# EAGLE design controller (EAGLE 4.11)
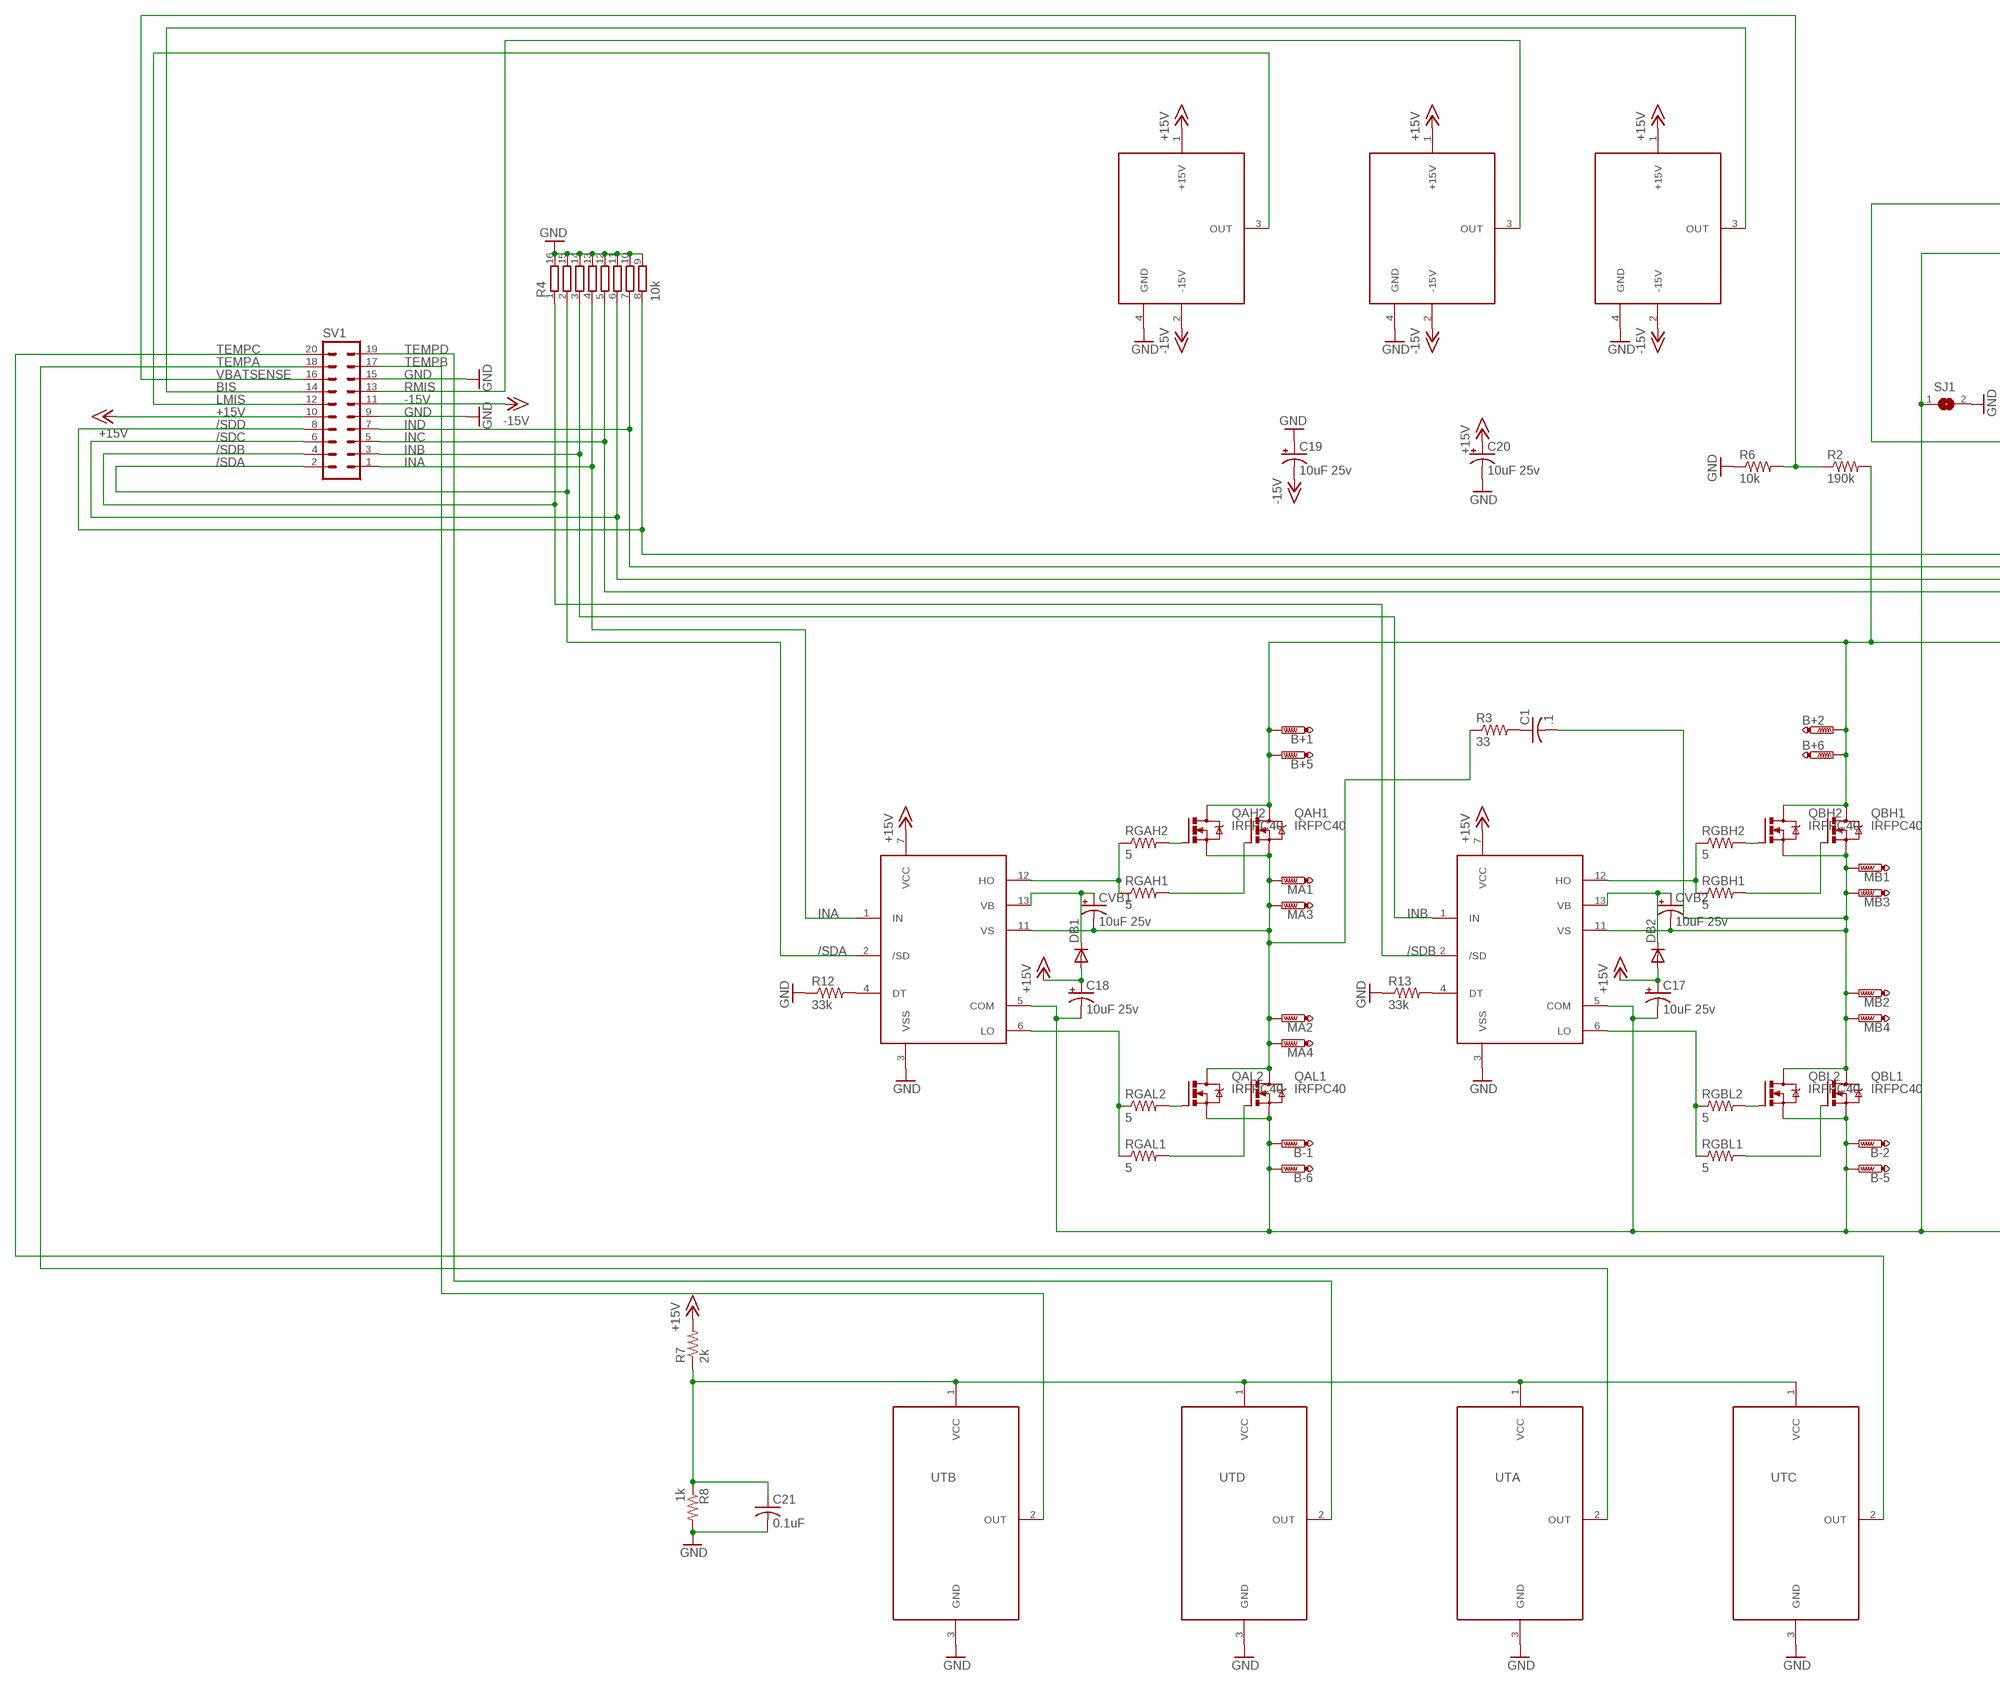
[diagram p0: schematic, sheet 1, part 1 of 2]
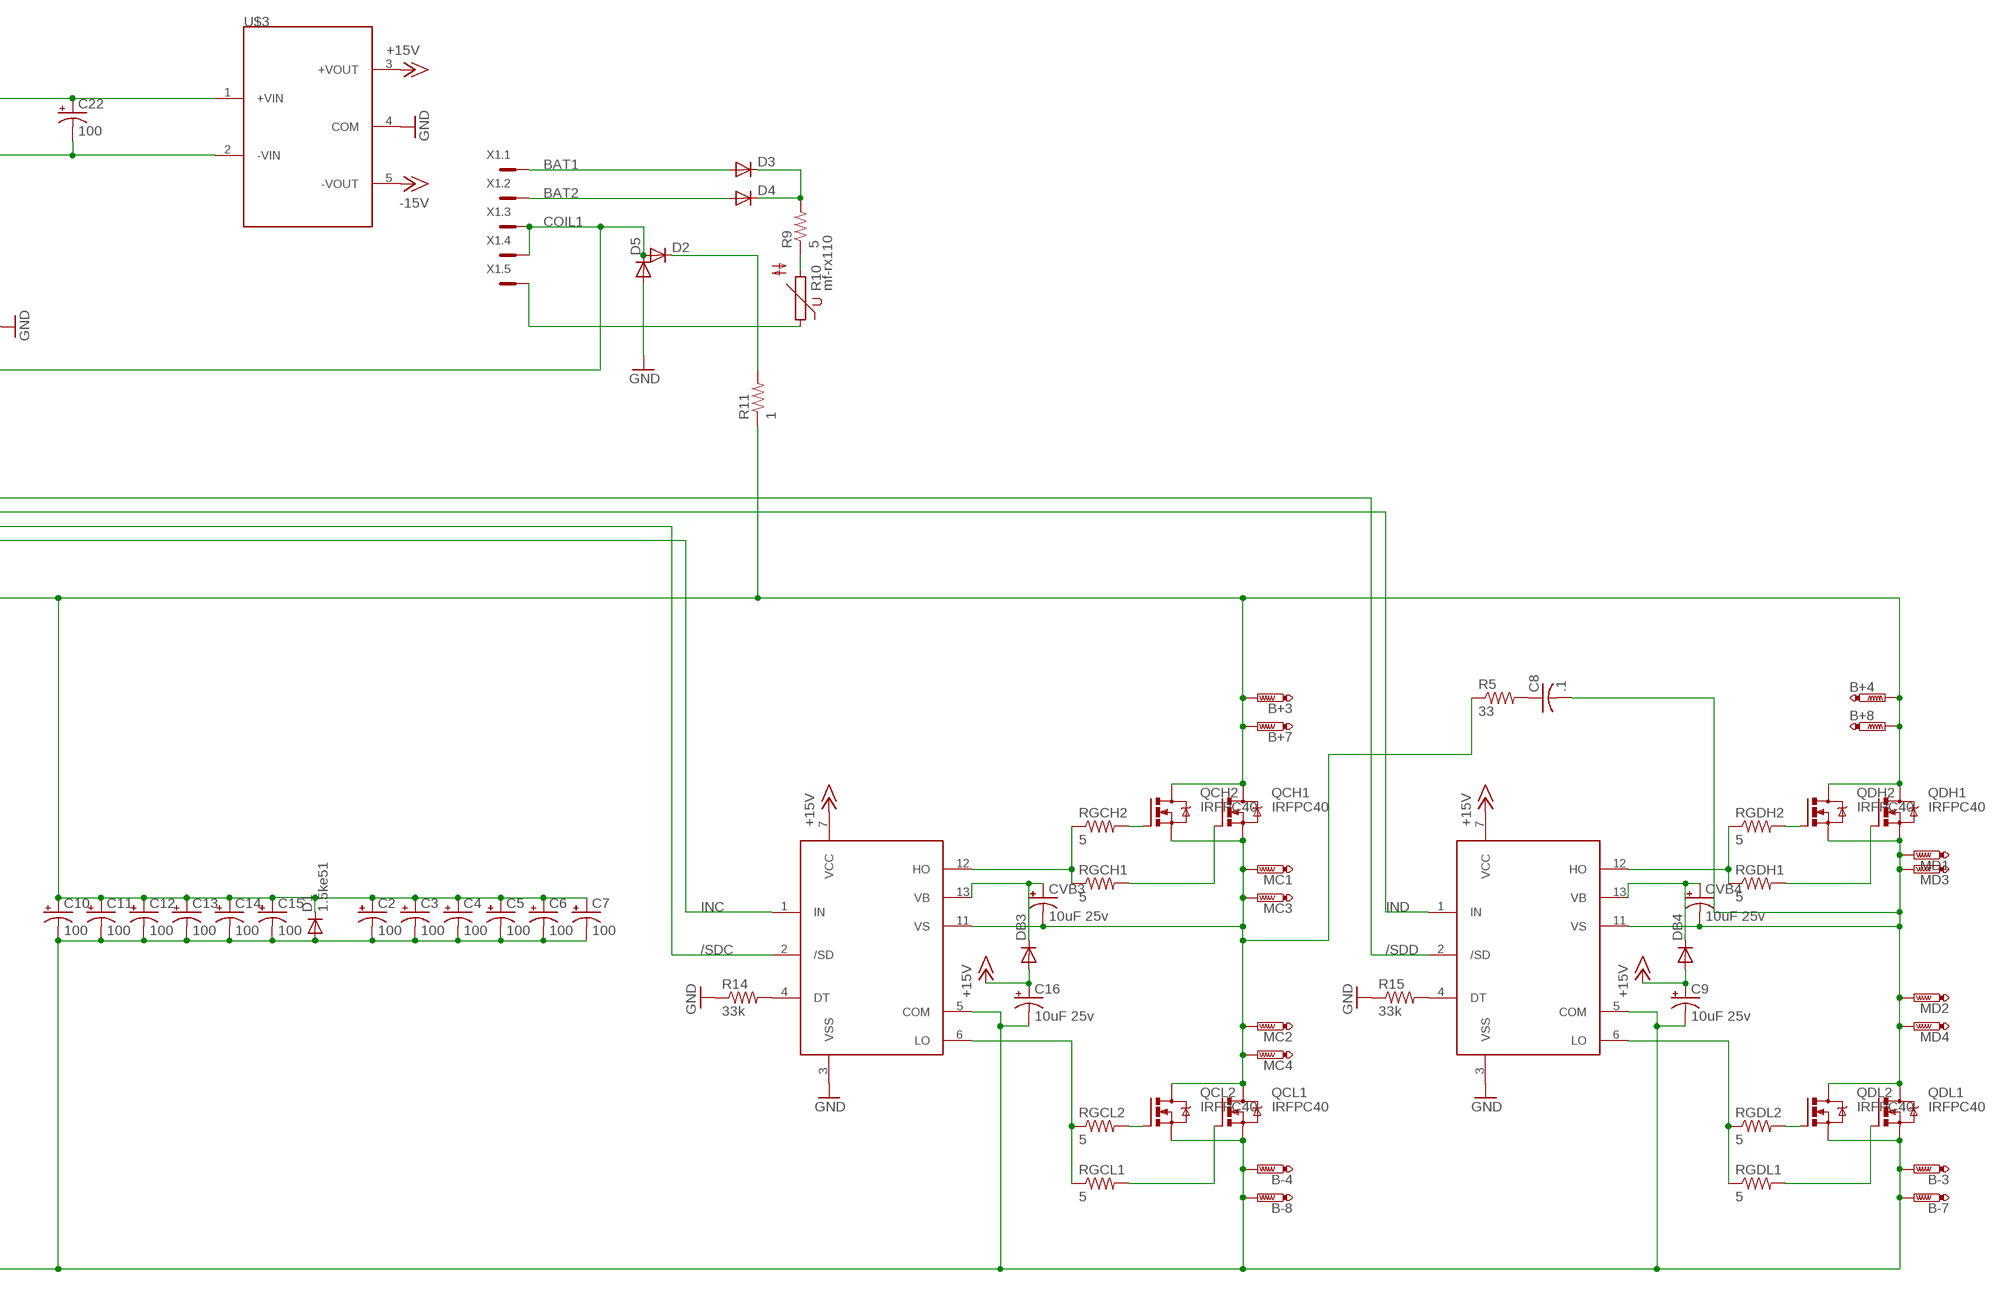
[diagram p1: schematic, sheet 1, part 2 of 2]

## Parts
B+1  PTR1PAD1-17Y  [P1-17Y]
B+2  PTR1PAD1-17Y  [P1-17Y]
B+3  PTR1PAD1-17Y  [P1-17Y]
B+4  PTR1PAD1-17Y  [P1-17Y]
B+5  PTR1PAD1-17Y  [P1-17Y]
B+6  PTR1PAD1-17Y  [P1-17Y]
B+7  PTR1PAD1-17Y  [P1-17Y]
B+8  PTR1PAD1-17Y  [P1-17Y]
B-1  PTR1PAD1-17Y  [P1-17Y]
B-2  PTR1PAD1-17Y  [P1-17Y]
B-3  PTR1PAD1-17Y  [P1-17Y]
B-4  PTR1PAD1-17Y  [P1-17Y]
B-5  PTR1PAD1-17Y  [P1-17Y]
B-6  PTR1PAD1-17Y  [P1-17Y]
B-7  PTR1PAD1-17Y  [P1-17Y]
B-8  PTR1PAD1-17Y  [P1-17Y]
C1  .1  C-US050-050X075  [C050-050X075]
C2  100  CPOL-USE2.5-7  [E2,5-7]
C3  100  CPOL-USE2.5-7  [E2,5-7]
C4  100  CPOL-USE2.5-7  [E2,5-7]
C5  100  CPOL-USE2.5-7  [E2,5-7]
C6  100  CPOL-USE2.5-7  [E2,5-7]
C7  100  CPOL-USE2.5-7  [E2,5-7]
C8  .1  C-US050-050X075  [C050-050X075]
C9  10uF 25v  CPOL-USC/6032-28R  [C/6032-28R]
C10  100  CPOL-USE2.5-7  [E2,5-7]
C11  100  CPOL-USE2.5-7  [E2,5-7]
C12  100  CPOL-USE2.5-7  [E2,5-7]
C13  100  CPOL-USE2.5-7  [E2,5-7]
C14  100  CPOL-USE2.5-7  [E2,5-7]
C15  100  CPOL-USE2.5-7  [E2,5-7]
C16  10uF 25v  CPOL-USC/6032-28R  [C/6032-28R]
C17  10uF 25v  CPOL-USC/6032-28R  [C/6032-28R]
C18  10uF 25v  CPOL-USC/6032-28R  [C/6032-28R]
C19  10uF 25v  CPOL-USC/6032-28R  [C/6032-28R]
C20  10uF 25v  CPOL-USC/6032-28R  [C/6032-28R]
C21  0.1uF  C-USC0805  [C0805]
C22  100  CPOL-USE2.5-7  [E2,5-7]
CVB1  10uF 25v  CPOL-USC/6032-28R  [C/6032-28R]
CVB2  10uF 25v  CPOL-USC/6032-28R  [C/6032-28R]
CVB3  10uF 25v  CPOL-USC/6032-28R  [C/6032-28R]
CVB4  10uF 25v  CPOL-USC/6032-28R  [C/6032-28R]
D1  1.5ke51  DIODE-DO201-15  [DO201-15]
D2  DIODE-DO41-10  [DO41-10]
D3  DIODE-DO41-10  [DO41-10]
D4  DIODE-DO41-10  [DO41-10]
D5  DIODE-DO41-10  [DO41-10]
DB1  DIODE-SOD323-W  [SOD323-W]
DB2  DIODE-SOD323-W  [SOD323-W]
DB3  DIODE-SOD323-W  [SOD323-W]
DB4  DIODE-SOD323-W  [SOD323-W]
DRV1  IR21844S  [14-SOIC]
DRV2  IR21844S  [14-SOIC]
DRV3  IR21844S  [14-SOIC]
DRV4  IR21844S  [14-SOIC]
MA1  PTR1PAD1-17Y  [P1-17Y]
MA2  PTR1PAD1-17Y  [P1-17Y]
MA3  PTR1PAD1-17Y  [P1-17Y]
MA4  PTR1PAD1-17Y  [P1-17Y]
MB1  PTR1PAD1-17Y  [P1-17Y]
MB2  PTR1PAD1-17Y  [P1-17Y]
MB3  PTR1PAD1-17Y  [P1-17Y]
MB4  PTR1PAD1-17Y  [P1-17Y]
MC1  PTR1PAD1-17Y  [P1-17Y]
MC2  PTR1PAD1-17Y  [P1-17Y]
MC3  PTR1PAD1-17Y  [P1-17Y]
MC4  PTR1PAD1-17Y  [P1-17Y]
MD1  PTR1PAD1-17Y  [P1-17Y]
MD2  PTR1PAD1-17Y  [P1-17Y]
MD3  PTR1PAD1-17Y  [P1-17Y]
MD4  PTR1PAD1-17Y  [P1-17Y]
QAH1  IRFPC40  [TO247BV]
QAH2  IRFPC40  [TO247BV]
QAL1  IRFPC40  [TO247BV]
QAL2  IRFPC40  [TO247BV]
QBH1  IRFPC40  [TO247BV]
QBH2  IRFPC40  [TO247BV]
QBL1  IRFPC40  [TO247BV]
QBL2  IRFPC40  [TO247BV]
QCH1  IRFPC40  [TO247BV]
QCH2  IRFPC40  [TO247BV]
QCL1  IRFPC40  [TO247BV]
QCL2  IRFPC40  [TO247BV]
QDH1  IRFPC40  [TO247BV]
QDH2  IRFPC40  [TO247BV]
QDL1  IRFPC40  [TO247BV]
QDL2  IRFPC40  [TO247BV]
R2  190k  R-US_R0805  [R0805]
R3  33  R-US_0414/15  [0414/15]
R4  10k  4816P-T01  [4816P]
R5  33  R-US_0414/15  [0414/15]
R6  10k  R-US_R0805  [R0805]
R7  2k  R-US_R0805  [R0805]
R8  1k  R-US_R0805  [R0805]
R9  5  R-US_0414/15  [0414/15]
R10  mf-rx110  S05K40  [S05K40]
R11  1  R-US_0414/15  [0414/15]
R12  33k  R-US_R0805  [R0805]
R13  33k  R-US_R0805  [R0805]
R14  33k  R-US_R0805  [R0805]
R15  33k  R-US_R0805  [R0805]
RGAH1  5  R-US_R0805  [R0805]
RGAH2  5  R-US_R0805  [R0805]
RGAL1  5  R-US_R0805  [R0805]
RGAL2  5  R-US_R0805  [R0805]
RGBH1  5  R-US_R0805  [R0805]
RGBH2  5  R-US_R0805  [R0805]
RGBL1  5  R-US_R0805  [R0805]
RGBL2  5  R-US_R0805  [R0805]
RGCH1  5  R-US_R0805  [R0805]
RGCH2  5  R-US_R0805  [R0805]
RGCL1  5  R-US_R0805  [R0805]
RGCL2  5  R-US_R0805  [R0805]
RGDH1  5  R-US_R0805  [R0805]
RGDH2  5  R-US_R0805  [R0805]
RGDL1  5  R-US_R0805  [R0805]
RGDL2  5  R-US_R0805  [R0805]
SJ1  SJ  [SJ]
SV1  MA10-2  [MA10-2]
U$1  L08P150D15  [L08P]
U$2  L08P150D15  [L08P]
U$3  DFC10U48D15  [DFC10]
U$5  L08P150D15  [L08P]
UTA  LM61BIM  [SOT23]
UTB  LM61BIM  [SOT23]
UTC  LM61BIM  [SOT23]
UTD  LM61BIM  [SOT23]
X1  MC5  [MC5]

## Nets
+15V [pwr]: C9.+ C16.+ C17.+ C18.+ C20.+ DB1.A DB2.A DB3.A DB4.A DRV1.7(VCC) DRV2.7(VCC) DRV3.7(VCC) DRV4.7(VCC) R7.2 SV1.10 U$1.1(+15V) U$2.1(+15V) U$3.3(+VOUT) U$5.1(+15V)
-15V [pwr]: C19.- SV1.11 U$1.2(-15V) U$2.2(-15V) U$3.5(-VOUT) U$5.2(-15V)
/SDA: DRV1.2(/SD) R4.2 SV1.2
/SDB: DRV2.2(/SD) R4.1 SV1.4
/SDC: DRV3.2(/SD) R4.6 SV1.6
/SDD: DRV4.2(/SD) R4.8 SV1.8
B+ [highpwr]: B+1.1(TP) B+2.1(TP) B+3.1(TP) B+4.1(TP) B+5.1(TP) B+6.1(TP) B+7.1(TP) B+8.1(TP) C2.+ C3.+ C4.+ C5.+ C6.+ C7.+ C10.+ C11.+ C12.+ C13.+ C14.+ C15.+ D1.C QAH1.D QAH2.D QBH1.D QBH2.D QCH1.D QCH2.D QDH1.D QDH2.D R2.2 R11.1
B- [highpwr]: B-1.1(TP) B-2.1(TP) B-3.1(TP) B-4.1(TP) B-5.1(TP) B-6.1(TP) B-7.1(TP) B-8.1(TP) C2.- C3.- C4.- C5.- C6.- C7.- C9.- C10.- C11.- C12.- C13.- C14.- C15.- C16.- C17.- C18.- C22.- D1.A DRV1.5(COM) DRV2.5(COM) DRV3.5(COM) DRV4.5(COM) QAL1.S QAL2.S QBL1.S QBL2.S QCL1.S QCL2.S QDL1.S QDL2.S SJ1.1 U$3.2(-VIN)
BAT1 [highsig]: D3.A X1.1
BAT2 [highsig]: D4.A X1.2
BIS: SV1.14 U$5.3(OUT)
COIL1 [highpwr]: C22.+ D2.A D5.C U$3.1(+VIN) X1.3 X1.4
GAH [highsig]: DRV1.12(HO) RGAH1.1 RGAH2.1
GAH1 [highsig]: DRV3.12(HO) RGCH1.1 RGCH2.1
GAL [highsig]: DRV1.6(LO) RGAL1.1 RGAL2.1
GAL1 [highsig]: DRV3.6(LO) RGCL1.1 RGCL2.1
GBH [highsig]: DRV2.12(HO) RGBH1.1 RGBH2.1
GBH1 [highsig]: DRV4.12(HO) RGDH1.1 RGDH2.1
GBL [highsig]: DRV2.6(LO) RGBL1.1 RGBL2.1
GBL1 [highsig]: DRV4.6(LO) RGDL1.1 RGDL2.1
GND [pwr]: C19.+ C20.- C21.2 D5.A DRV1.3(VSS) DRV2.3(VSS) DRV3.3(VSS) DRV4.3(VSS) R4.9 R4.10 R4.11 R4.12 R4.13 R4.14 R4.15 R4.16 R6.1 R8.2 R12.1 R13.1 R14.1 R15.1 SJ1.2 SV1.9 SV1.15 U$1.4(GND) U$2.4(GND) U$3.4(COM) U$5.4(GND) UTA.3(GND) UTB.3(GND) UTC.3(GND) UTD.3(GND)
INA: DRV1.1(IN) R4.4 SV1.1
INB: DRV2.1(IN) R4.3 SV1.3
INC: DRV3.1(IN) R4.5 SV1.5
IND: DRV4.1(IN) R4.7 SV1.7
LM61PWR: C21.1 R7.1 R8.1 UTA.1(VCC) UTB.1(VCC) UTC.1(VCC) UTD.1(VCC)
LMIS: SV1.12 U$1.3(OUT)
MA1 [highpwr]: CVB3.- DRV3.11(VS) MC1.1(TP) MC2.1(TP) MC3.1(TP) MC4.1(TP) QCH1.S QCH2.S QCL1.D QCL2.D R5.1
MA2 [highpwr]: CVB1.- DRV1.11(VS) MA1.1(TP) MA2.1(TP) MA3.1(TP) MA4.1(TP) QAH1.S QAH2.S QAL1.D QAL2.D R3.1
MB1 [highpwr]: C8.2 CVB4.- DRV4.11(VS) MD1.1(TP) MD2.1(TP) MD3.1(TP) MD4.1(TP) QDH1.S QDH2.S QDL1.D QDL2.D
MB2 [highpwr]: C1.2 CVB2.- DRV2.11(VS) MB1.1(TP) MB2.1(TP) MB3.1(TP) MB4.1(TP) QBH1.S QBH2.S QBL1.D QBL2.D
N$1 [highpwr]: D2.C R11.2
N$2: C1.1 R3.2
N$3: DRV1.4(DT) R12.2
N$4: C8.1 R5.2
N$5: DRV3.4(DT) R14.2
N$6: DRV4.4(DT) R15.2
N$7 [highsig]: R9.1 R10.2
N$8 [highsig]: D3.C D4.C R9.2
N$9: DRV2.4(DT) R13.2
N$10 [highpwr]: R10.1 X1.5
Q1G [highsig]: QAH1.G RGAH1.2
Q1G1 [highsig]: QCH1.G RGCH1.2
Q2G [highsig]: QAH2.G RGAH2.2
Q2G1 [highsig]: QCH2.G RGCH2.2
Q3G [highsig]: QAL1.G RGAL1.2
Q3G1 [highsig]: QCL1.G RGCL1.2
Q4G [highsig]: QAL2.G RGAL2.2
Q4G1 [highsig]: QCL2.G RGCL2.2
Q5G [highsig]: QBH1.G RGBH1.2
Q5G1 [highsig]: QDH1.G RGDH1.2
Q6G [highsig]: QBH2.G RGBH2.2
Q6G1 [highsig]: QDH2.G RGDH2.2
Q7G [highsig]: QBL1.G RGBL1.2
Q7G1 [highsig]: QDL1.G RGDL1.2
Q8G [highsig]: QBL2.G RGBL2.2
Q8G1 [highsig]: QDL2.G RGDL2.2
RMIS: SV1.13 U$2.3(OUT)
TEMPA: SV1.18 UTA.2(OUT)
TEMPB: SV1.17 UTB.2(OUT)
TEMPC: SV1.20 UTC.2(OUT)
TEMPD: SV1.19 UTD.2(OUT)
VB1 [pwr]: CVB1.+ DB1.C DRV1.13(VB)
VB2 [pwr]: CVB2.+ DB2.C DRV2.13(VB)
VB3 [pwr]: CVB3.+ DB3.C DRV3.13(VB)
VB4 [pwr]: CVB4.+ DB4.C DRV4.13(VB)
VBATSENSE: R2.1 R6.2 SV1.16

## Library data of the parts
B+1-B+8 B-1-B-8 MA1-MA4 MB1-MB4 MC1-MC4 MD1-MD4 = testpad:PTR1: TEST PIN
C1 C8 C21 = rcl:C-US: CAPACITOR, American symbol
C2-C7 C9-C20 C22 CVB1-CVB4 = rcl:CPOL-US: POLARIZED CAPACITOR, American symbol
D1-D5 DB1-DB4 = diode:DIODE-: DIODE
DRV1-DRV4 = tlb:IR21844S
QAH1 QAH2 QAL1 QAL2 QBH1 QBH2 QBL1 QBL2 QCH1 QCH2 QCL1 QCL2 QDH1 QDH2 QDL1 QDL2 = transistor-power:IRFPC40: N-CHANNEL MOS FET
R2 R3 R5-R9 R11-R15 RGAH1 RGAH2 RGAL1 RGAL2 RGBH1 RGBH2 RGBL1 RGBL2 RGCH1 RGCH2 RGCL1 RGCL2 RGDH1 RGDH2 RGDL1 RGDL2 = rcl:R-US_: RESISTOR, American symbol
R4 = resistor-bourns:4816P-T01: BOURNS RESISTOR NETWORK
R10 = varistor:S05K40: VARISTOR
SJ1 = jumper:SJ: SMD solder JUMPER
SV1 = con-lstb:MA10-2: PIN HEADER
U$1 U$2 U$5 = tlb:L08P150D15
U$3 = tlb:DFC10U48D15
UTA UTB UTC UTD = tlb:LM61BIM
X1 = con-phoenix-381_l:MC5: Mini-Combicon 3.81mm horizontal 5-polig (ohne Gegenstecker)

## Net classes
0 default: width 0.203 mm
1 highpwr: width 0.61 mm, clearance 0.813 mm
2 highsig: width 0.406 mm, clearance 0.61 mm
3 pwr: width 0.61 mm, clearance 0.61 mm

## Board
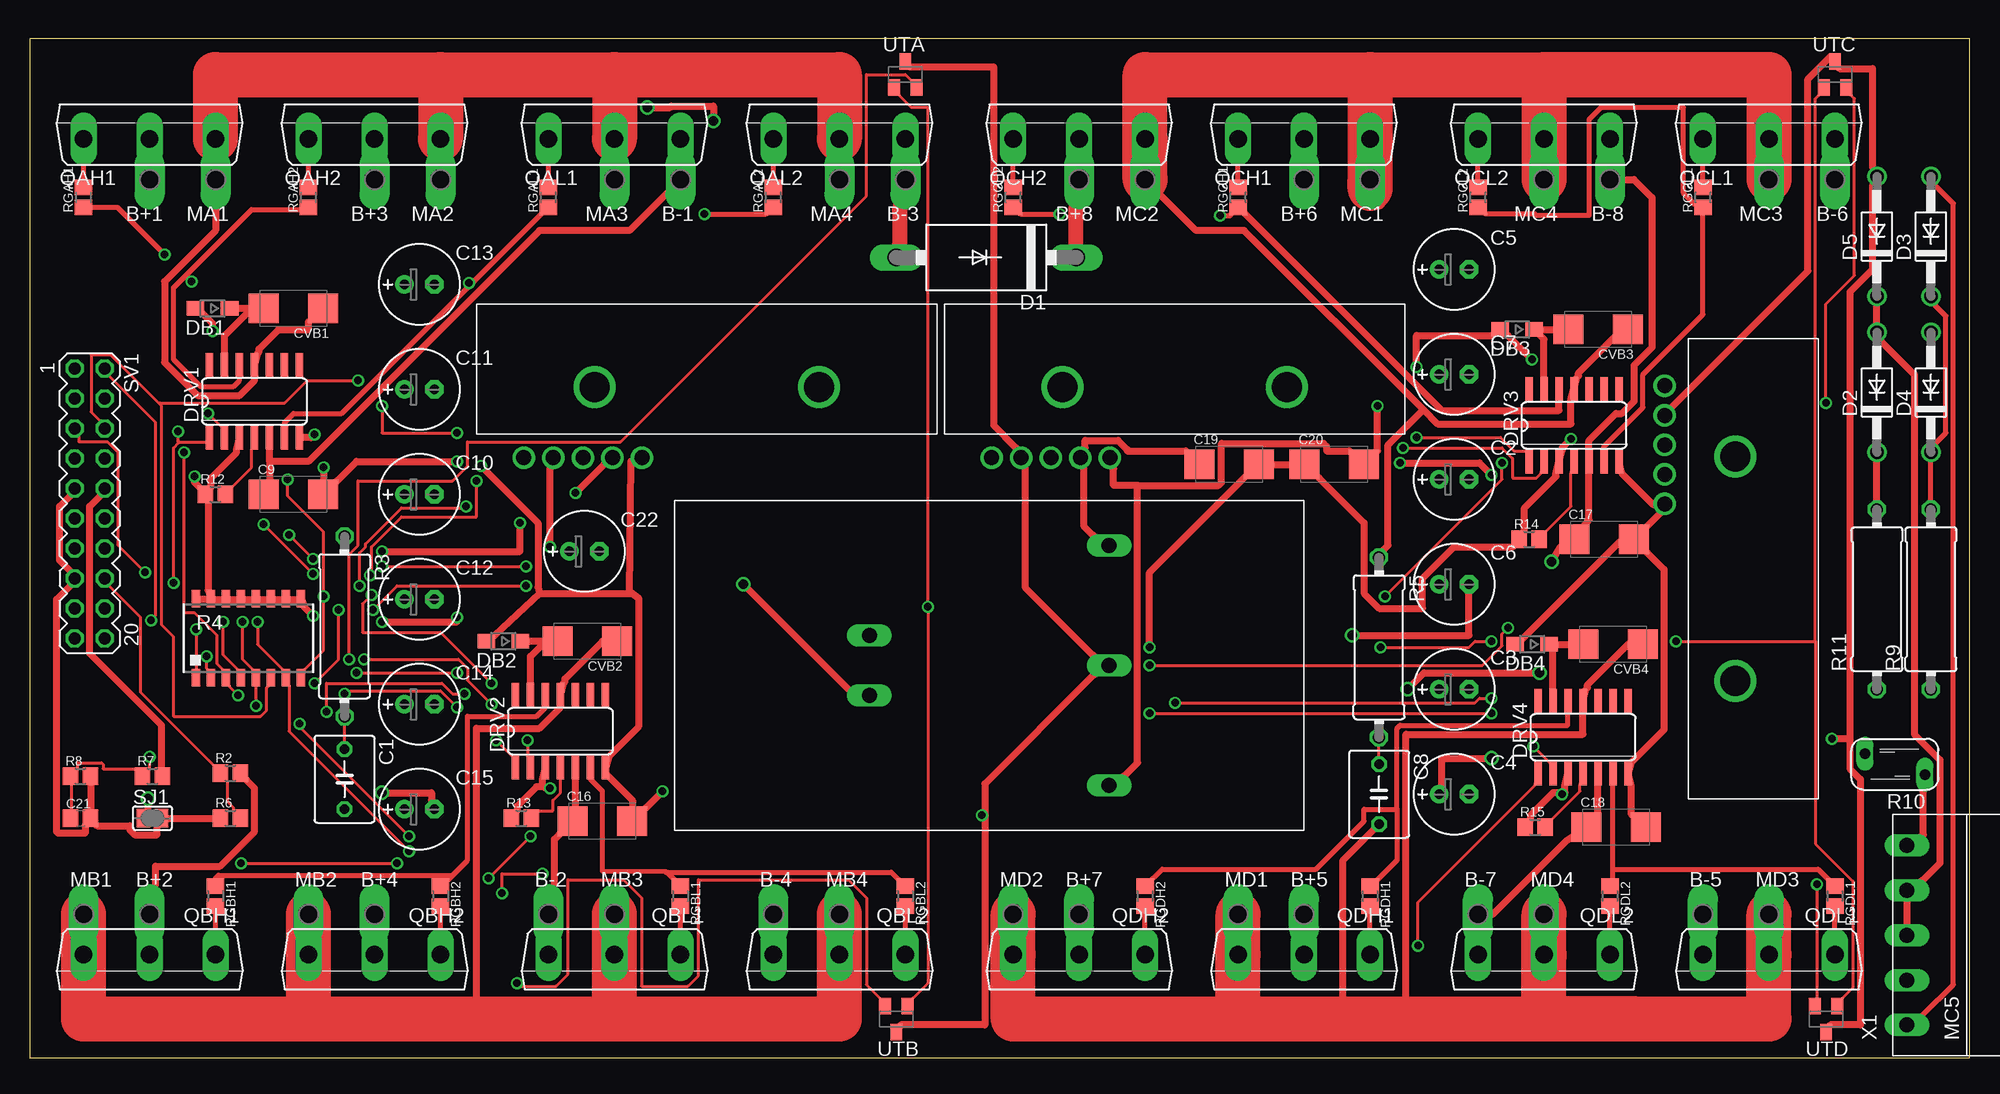
[diagram p2: board, top side]
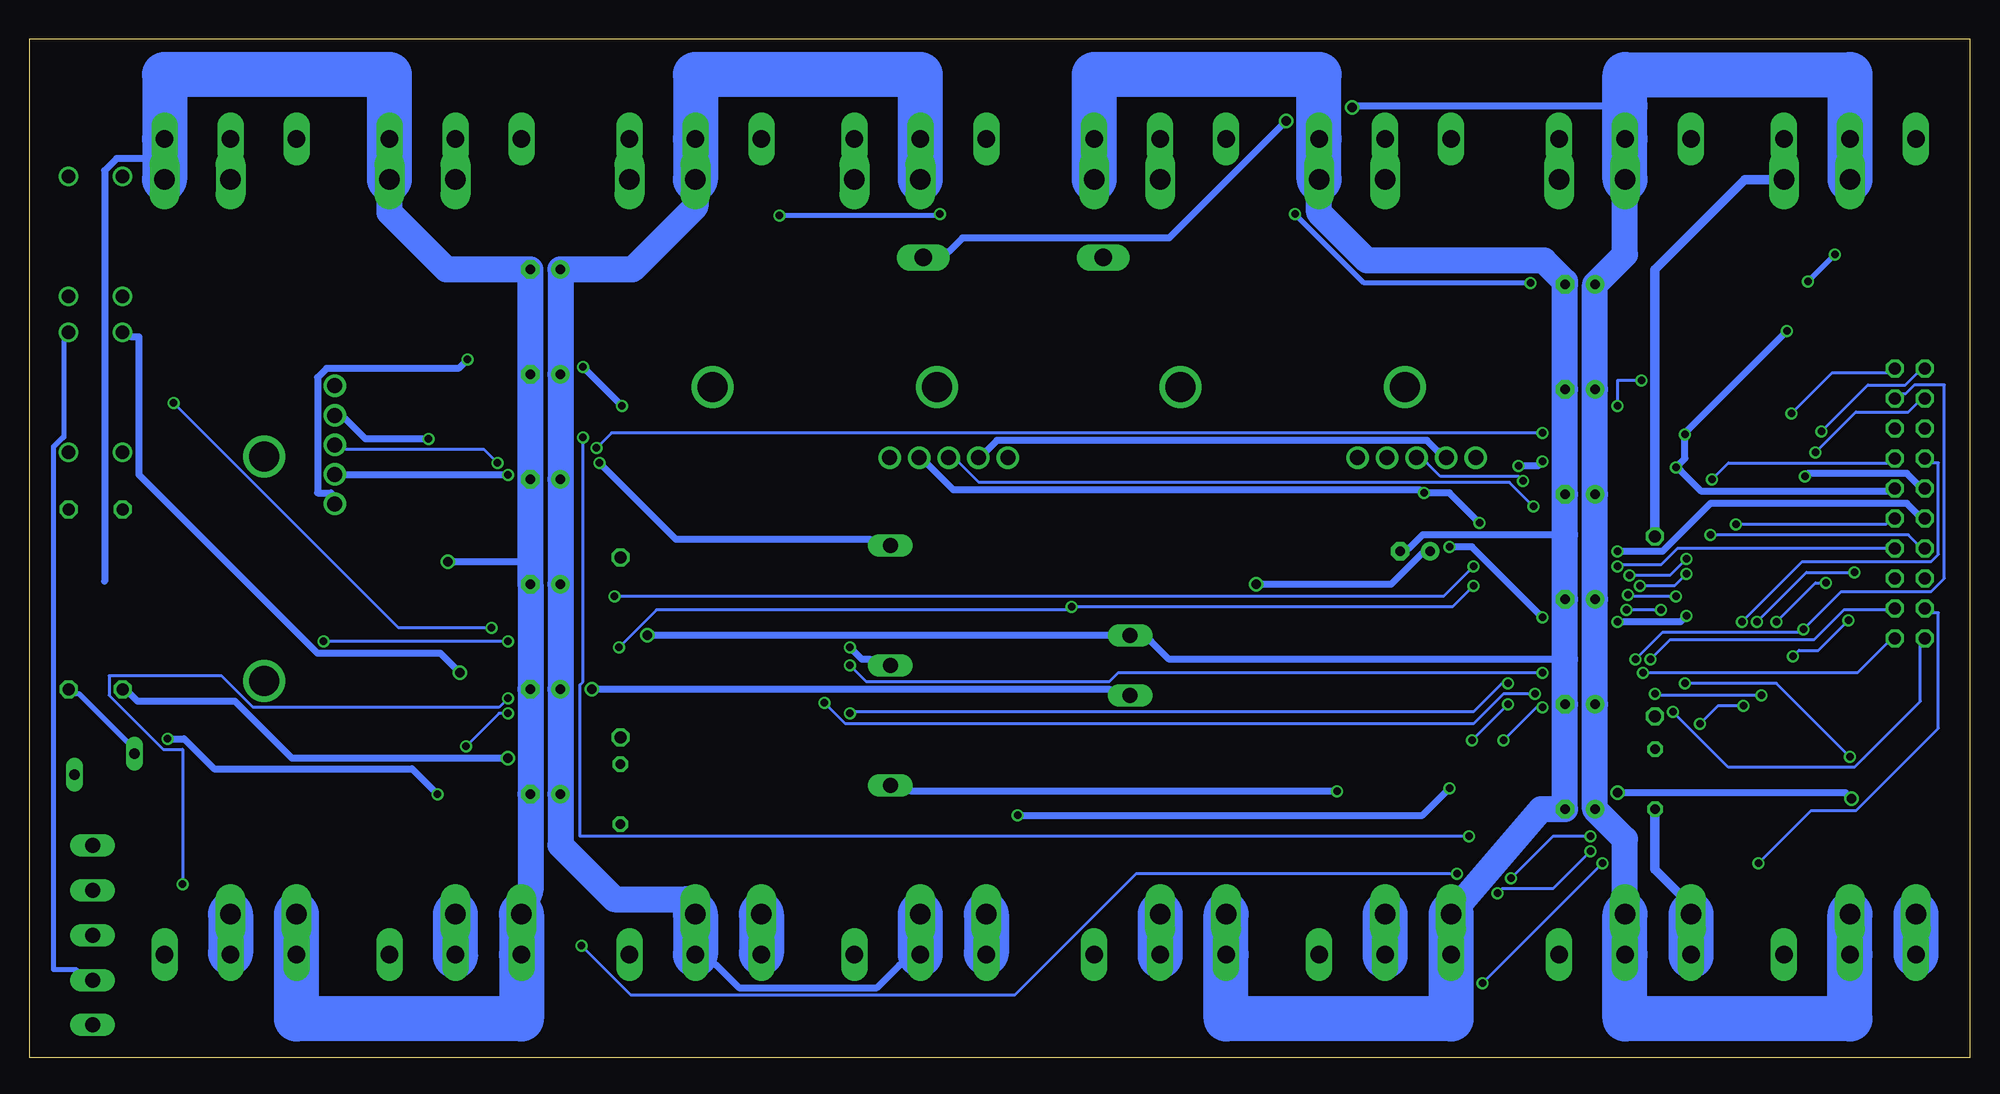
[diagram p3: board, bottom side, seen from below]

Size 164.34 x 86.36 mm. Coordinates in mm from the lower left corner, seen from the top.
Outline: 0,0 164.34,0 164.34,86.36 0,86.36 0,0
Copper layers (1*16): Top 0.035mm / dielectric 1.5mm / Bottom 0.035mm
Design rules "default": minimum track width 10mil, minimum drill 24mil, track to track 8mil, track to pad 8mil, pad to pad 8mil, via to via 8mil, smd to smd 8mil, copper to edge 40mil, drill to drill 8mil, minimum pad ring 10mil, minimum via ring 8mil, stop-mask expansion 4mil, vias tented up to drill 0mil, thermal gap 10mil

### Footprints (pad centres in the part's own frame; a part is rotated, then mirrored left to right if it is on the bottom)
P1-17Y = drill 1.702 pad 2.121 long: 1 0,0
C050-050X075 = drill 0.813 octagon: 1 -2.54,0; 2 2.54,0
E2,5-7 = drill 0.813 pad 1.6 round: + -1.27,0 | drill 0.813 pad 1.6 octagon: - 1.27,0
C/6032-28R = smd 2.55 x 2.5: + 2.525,0; - -2.525,0
C0805 = smd 1.3 x 1.5: 1 -0.85,0; 2 0.85,0
DO201-15 = drill 1.499 long: A 7.62,0; C -7.62,0
DO41-10 = drill 1.118 round: A 5.08,0; C -5.08,0
SOD323-W = smd 1.5 x 1.2: A 1.45,0; C -1.45,0
14-SOIC = smd 0.66 x 2.032: 1 -3.81,-3.073; 2 -2.54,-3.073; 3 -1.27,-3.073; 4 0,-3.073; 5 1.27,-3.073; 6 2.54,-3.073; 7 3.81,-3.073; 8 3.81,3.073; 9 2.54,3.073; 10 1.27,3.073; 11 0,3.073; 12 -1.27,3.073; 13 -2.54,3.073; 14 -3.81,3.073
TO247BV = drill 1.499 long: D 0,-2.921; G -5.588,-2.921; S 5.588,-2.921
R0805 = smd 1.3 x 1.5: 1 -0.85,0; 2 0.85,0
0414/15 = drill 1.016 octagon: 1 -7.62,0; 2 7.62,0
4816P = smd 0.7 x 1.5: 1 -4.445,-3.346; 2 -3.175,-3.346; 3 -1.905,-3.346; 4 -0.635,-3.346; 5 0.635,-3.346; 6 1.905,-3.346; 7 3.175,-3.346; 8 4.445,-3.346; 9 4.445,3.346; 10 3.175,3.346; 11 1.905,3.346; 12 0.635,3.346; 13 -0.635,3.346; 14 -1.905,3.346; 15 -3.175,3.346; 16 -4.445,3.346
S05K40 = drill 0.914 long: 1 -0.889,-2.54; 2 0.889,2.54
SJ = smd 1.168 x 1.6: 1 -0.762,0; 2 0.762,0
MA10-2 = drill 1.016 octagon: 1 -11.43,-1.27; 2 -11.43,1.27; 3 -8.89,-1.27; 4 -8.89,1.27; 5 -6.35,-1.27; 6 -6.35,1.27; 7 -3.81,-1.27; 8 -3.81,1.27; 9 -1.27,-1.27; 10 -1.27,1.27; 11 1.27,-1.27; 12 1.27,1.27; 13 3.81,-1.27; 14 3.81,1.27; 15 6.35,-1.27; 16 6.35,1.27; 17 8.89,-1.27; 18 8.89,1.27; 19 11.43,-1.27; 20 11.43,1.27
L08P = drill 1.27 round: 1 -3,-3; 2 -5.5,-3; 3 -8,-3; 4 -10.5,-3; 5 -13,-3 | drill 2.54 round: P$6 -7,3; P$7 12,3
DFC10 = drill 1.27 long: 1 0,-2.54; 2 0,2.54; 3 20.32,-10.16; 4 20.32,0; 5 20.32,10.16
SOT23 = smd 1 x 1.4: 1 -0.95,-1.1; 2 0.95,-1.1; 3 0,1.1
MC5 = drill 1.27 long: 1 -7.62,0; 2 -3.81,0; 3 0,0; 4 3.81,0; 5 7.62,0

### Placement (x,y rotation side)
B+1  10.16,74.42 180 top
B+2  10.16,12.19 0 top
B+3  29.21,74.42 180 top
B+4  29.21,12.19 0 top
B+5  107.95,12.19 0 top
B+6  107.95,74.42 180 top
B+7  88.9,12.19 0 top
B+8  88.9,74.42 180 top
B-1  55.12,74.42 180 top
B-2  43.94,12.19 0 top
B-3  74.17,74.42 180 top
B-4  62.99,12.19 0 top
B-5  141.73,12.19 0 top
B-6  152.91,74.42 180 top
B-7  122.68,12.19 0 top
B-8  133.86,74.42 180 top
C1  26.67,23.62 270 top
C2  120.65,49.02 0 top
C3  120.65,31.24 0 top
C4  120.65,22.35 0 top
C5  120.65,66.8 0 top
C6  120.65,40.13 0 top
C7  120.65,57.91 0 top
C8  114.3,22.35 270 top
C9  22.35,47.75 0 top
C10  33.02,47.75 0 top
C11  33.02,56.64 0 top
C12  33.02,38.86 0 top
C13  33.02,65.53 0 top
C14  33.02,29.97 0 top
C15  33.02,21.08 0 top
C16  48.51,20.07 0 top
C17  133.35,43.94 0 top
C18  134.37,19.56 0 top
C19  101.6,50.29 0 top
C20  110.49,50.29 0 top
C21  4.32,20.32 0 top
C22  46.99,42.93 0 top
CVB1  22.35,63.5 180 top
CVB2  47.24,35.31 180 top
CVB3  132.84,61.72 180 top
CVB4  134.11,35.05 180 top
D1  81.03,67.82 180 top
D2  156.46,56.39 90 top
D3  161.04,69.6 90 top
D4  161.04,56.39 90 top
D5  156.46,69.6 90 top
DB1  15.49,63.5 180 top
DB2  40.13,35.31 180 top
DB3  125.98,61.72 180 top
DB4  127.25,35.05 180 top
DRV1  19.05,55.63 0 top
DRV2  44.96,27.69 0 top
DRV3  130.81,53.59 0 top
DRV4  131.57,27.18 0 top
MA1  15.75,74.42 180 top
MA2  34.8,74.42 180 top
MA3  49.53,74.42 180 top
MA4  68.58,74.42 180 top
MB1  4.57,12.19 0 top
MB2  23.62,12.19 0 top
MB3  49.53,12.19 0 top
MB4  68.58,12.19 0 top
MC1  113.54,74.42 180 top
MC2  94.49,74.42 180 top
MC3  147.32,74.42 180 top
MC4  128.27,74.42 180 top
MD1  102.36,12.19 0 top
MD2  83.31,12.19 0 top
MD3  147.32,12.19 0 top
MD4  128.27,12.19 0 top
QAH1  10.16,80.77 0 top
QAH2  29.21,80.77 0 top
QAL1  49.53,80.77 0 top
QAL2  68.58,80.77 0 top
QBH1  10.16,5.84 180 top
QBH2  29.21,5.84 180 top
QBL1  49.53,5.84 180 top
QBL2  68.58,5.84 180 top
QCH1  107.95,80.77 0 top
QCH2  88.9,80.77 0 top
QCL1  147.32,80.77 0 top
QCL2  128.27,80.77 0 top
QDH1  107.95,5.84 180 top
QDH2  88.9,5.84 180 top
QDL1  147.32,5.84 180 top
QDL2  128.27,5.84 180 top
R2  17.02,24.13 0 top
R3  26.67,36.58 270 top
R4  18.54,35.56 0 top
R5  114.3,34.8 270 top
R6  17.02,20.32 0 top
R7  10.41,23.88 0 top
R8  4.32,23.88 0 top
R9  161.04,38.86 90 top
R10  157.99,24.89 90 top
R11  156.46,38.86 90 top
R12  15.75,47.75 0 top
R13  41.66,20.32 0 top
R14  127,43.94 0 top
R15  127.51,19.56 0 top
RGAH1  4.57,72.9 90 top
RGAH2  23.62,72.9 90 top
RGAL1  43.94,72.9 90 top
RGAL2  62.99,72.9 90 top
RGBH1  15.75,13.72 270 top
RGBH2  34.8,13.72 270 top
RGBL1  55.12,13.72 270 top
RGBL2  74.17,13.72 270 top
RGCH1  102.36,72.9 90 top
RGCH2  83.31,72.9 90 top
RGCL1  141.73,72.9 90 top
RGCL2  122.68,72.9 90 top
RGDH1  113.54,13.72 270 top
RGDH2  94.49,13.72 270 top
RGDL1  152.91,13.72 270 top
RGDL2  133.86,13.72 270 top
SJ1  10.41,20.32 0 top
SV1  5.08,46.99 270 top
U$1  94.49,53.85 0 top
U$2  54.86,53.85 0 top
U$3  71.12,33.27 0 top
U$5  141.48,43.94 270 top
UTA  74.17,83.31 0 top
UTB  73.41,3.3 180 top
UTC  152.91,83.31 0 top
UTD  152.15,3.3 180 top
X1  159,10.41 90 top

### Tracks (layer width: path | path; a pad name or v marks a point on that pad's centre or on a via)
+15V  (via drill 0.61)
  Top 0.61: DRV1.7 23.85,52.55 v24.13,52.83 | v24.89,50.04 24.89,47.75 C9.+ 26.04,48.9 27.69,50.55 v36.2,50.55 | v127.25,59.18 125.22,61.21 DB3.A 123.83,61.21 117.48,61.21 v117.48,58.55 | DRV3.7 134.87,49.53 137.54,46.86 U$5.1 138.05,46.1 137.03,45.09 C17.+ | C18.+ 135.64,20.7 135.64,23.11 DRV4.7 135.64,25.02 138.43,27.81 138.43,41.4 137.03,42.8 C17.+ | DB4.A 126.49,35.56 134.62,43.69 C17.+ | v15.49,61.59 15.49,62.23 14.73,62.99 DB1.A | R7.2 11.18,24.51 11.18,28.19 5.08,34.29 5.08,46.74 5.97,47.62 SV1.10 | 43.18,39.37 39.37,35.81 DB2.A | 43.18,39.37 50.8,39.37 | 50.8,39.37 50.93,50.55 U$2.1 | 50.8,39.37 51.05,39.37 51.56,38.99 51.56,28.07 49.02,25.53 DRV2.7 48.77,24.13 51.05,21.84 51.05,20.07 C16.+ 52.2,21.21 v53.59,22.61 | 93.85,48.51 91.82,48.51 91.82,49.91 U$1.1 | 93.85,48.51 100.71,48.51 100.97,48.77 100.97,52.07 109.6,52.07 109.86,51.82 109.86,51.44 111.76,51.44 C20.+ 114.17,51.44 v114.17,55.24 | U$3.3 92.84,24 93.85,25.02 93.85,48.51 | v38.23,50.16 43.05,45.34 43.05,39.88 43.18,39.37
  Bottom 0.61: v127.25,59.18 128.02,58.42 139.19,58.42 139.95,57.66 139.95,47.88 138.81,47.88 U$5.1 | v15.49,61.59 23.88,53.21 v24.13,52.83 24.13,50.8 v24.89,50.04 24.51,49.78 22.73,48.01 6.99,48.01 SV1.10 | v36.2,50.55 36.58,50.16 v38.23,50.16 | v114.17,55.24 v117.48,58.55 | v53.59,22.61 89.66,22.61 U$3.3
-15V  (via drill 0.61)
  Top 0.61: v29.84,42.93 41.53,42.93 v41.53,45.34 | v46.23,47.88 48.64,50.29 U$2.2 | C19.- 97.92,51.44 92.96,51.44 92.96,51.56 92.2,52.32 89.41,52.32 89.41,51.69 U$1.2 89.28,49.91 89.28,45.09 90.04,44.32 U$3.5 | v123.83,49.4 122.81,50.42 v116.08,50.42
  Bottom 0.61: v29.84,42.93 26.04,42.93 21.97,46.99 5.33,46.99 4.45,46.1 SV1.11 | v41.53,45.34 44.07,47.88 v46.23,47.88 46.61,48.13 86.11,48.13 88.27,50.29 U$1.2 | v123.83,49.4 137.54,49.4 U$5.2 | v116.08,50.42 109.6,43.94 93.22,43.94 U$3.5
/SDA  (via drill 0.61)
  Top 0.254: v14.99,34.04 14.99,33.02 15.11,32.89 R4.2 | v10.29,37.08 10.67,37.47 10.67,53.85 6.73,57.78 SV1.2 | v15.11,54.61 16.26,53.47 DRV1.2
  Bottom 0.254: v14.99,34.04 14.48,34.54 12.83,34.54 v10.29,37.08 | v15.11,54.61 11.68,58.04 6.99,58.04 SV1.2
/SDB  (via drill 0.61)
  Top 0.254: v14.1,36.32 R4.1 | v42.16,26.92 42.16,25.53 DRV2.2 | v39.12,29.97 37.08,32 37.08,33.02 36.32,33.78 v28.32,33.78
  Bottom 0.254: SV1.4 5.71,56.26 5.46,56.26 4.7,57.02 2.16,57.02 2.16,40.64 3.3,39.5 10.92,39.5 v14.1,36.32 14.48,36.07 26.04,36.07 v28.32,33.78 | v39.12,29.97 v42.16,26.92
/SDC  (via drill 0.61)
  Top 0.254: 10.98,55.44 6.86,59.56 5.21,59.56 5.21,54.74 5.97,53.98 SV1.6 | 10.98,55.44 11.18,55.24 11.18,36.7 12.19,35.69 12.19,28.96 19.56,28.96 20.07,29.46 20.07,31.37 20.19,31.5 R4.6 | v116.33,51.69 124.71,51.69 125.6,50.8 125.6,49.15 127.64,49.15 128.02,49.53 DRV3.2 | v36.2,52.96 29.84,52.96 v29.84,55.24 | v27.81,57.4 23.49,57.4 21.59,55.5 11.05,55.5 10.98,55.44
  Bottom 0.254: v116.33,51.69 115.06,52.96 v36.2,52.96 | v29.84,55.24 29.84,57.4 v27.81,57.4
/SDD  (via drill 0.61)
  Top 0.254: v21.84,49.02 21.84,47.62 24.89,44.58 v24.89,39.12 24.89,34.54 23.24,32.89 R4.8 | v127.38,26.42 128.78,25.02 DRV4.2 | v94.87,29.21 v123.83,29.21 | v39.12,31.75 34.8,36.07 28.19,36.07 28.19,38.48 v28.96,39.24
  Bottom 0.254: v21.84,49.02 20.45,50.42 6.99,50.42 SV1.8 | v127.38,26.42 124.59,29.21 v123.83,29.21 | v94.87,29.21 94.74,29.34 42.04,29.34 39.62,31.75 v39.12,31.75 | v28.96,39.24 28.83,39.12 v24.89,39.12
B+  (via drill 0.81)
  Top 0.61: R2.2 18.41,23.5 19.05,22.86 19.05,19.18 16.13,16.26 10.67,16.26 10.67,14.73 B+2.1 | v123.83,25.4 119.63,25.4 119.63,23.11 C4.+ | v52.32,80.52 54.23,80.52 54.36,80.64 57.91,80.64 v57.91,79.38
  Top 1.27: D1.C 88.65,71.88 B+8.1
  Bottom 0.61: QDH2.D 90.68,7.87 92.58,5.97 104.27,5.97 106.17,7.87 QDH1.D | v123.83,25.4 142.11,25.4 146.94,30.23 155.19,30.23 155.83,30.86 R11.1 | v52.32,80.52 52.2,80.64 29.21,80.64 | v57.91,79.38 67.82,69.47 85.34,69.47 86.49,68.33 D1.C
  Bottom 2.184: C11.+ C13.+ 29.21,68.07 B+3.1 | C12.+ C14.+ C15.+ 29.21,18.54 B+4.1 | C12.+ C10.+ | C10.+ C11.+ | C5.+ 113.28,66.8 107.95,72.14 B+6.1 | B+5.1 108.71,13.46 114.81,13.46 119.38,18.03 C4.+ C3.+ C6.+ C2.+ C7.+ | C5.+ C7.+ | C5.+ C7.+ | C10.+ C11.+ | C12.+ C10.+
  Bottom 3.81: B+1.1 QAH1.D 10.16,83.31 29.21,83.31 29.21,80.64 QAH2.D B+3.1 | B+5.1 QDH1.D | QDH2.D B+7.1 | B+2.1 QBH1.D 10.16,3.3 29.21,3.3 QBH2.D B+4.1 | B+6.1 QCH1.D 107.95,83.31 88.9,83.31 QCH2.D B+8.1
B-  (via drill 0.81)
  Top 0.61: DRV4.5 132.84,20.7 C18.- 130.18,18.41 123.95,12.19 B-7.1 | v128.91,42.04 129.67,43.31 C17.- 132.02,45.54 132.08,45.59 DRV3.5 132.08,52.32 134.37,54.61 134.87,54.61 135.89,55.63 135.89,58.67 137.41,60.2 137.41,72.9 135.89,74.42 B-8.1 | 20.32,50.55 20.32,48.9 C9.- | 20.32,50.55 DRV1.5 | DRV2.5 46.23,21.21 C16.- 44.83,18.92 44.45,18.54 44.45,14.73 B-2.1 | v10.03,21.97 10.03,21.08 SJ1.1 | v29.84,22.48 34.04,22.48 34.04,21.84 C15.- | v112.01,35.81 121.92,35.81 C6.- | 20.32,50.55 23.62,50.55 43.18,70.1 50.8,70.1 B-1.1
  Top 1.27: D1.A 73.66,68.83 73.66,71.88 B-3.1
  Bottom 0.61: 157.99,40.39 157.99,75.18 156.97,76.2 152.91,76.2 | v10.03,21.97 10.54,22.48 v29.84,22.48 | C22.- 47.5,43.18 46.35,44.32 34.29,44.32 | 34.29,33.78 67.82,33.78 69.34,35.31 U$3.2 v112.01,35.81 | 121.92,42.04 v128.91,42.04
  Bottom 2.184: C10.- 34.29,44.32 C12.- 34.29,33.78 C14.- | C10.- C11.- | C11.- C13.- 34.29,65.79 36.07,67.56 51.05,67.56 55.12,71.63 B-1.1 | C15.- 36.32,21.08 B-2.1 | B-7.1 121.92,14.22 C4.- C3.- C6.- 121.92,42.04 C2.- | C2.- C7.- | C7.- C5.- 129.03,66.8 133.86,71.63 B-8.1 | C2.- C7.- | C10.- C11.- | C15.- C14.- | C15.- C14.-
  Bottom 3.81: B-1.1 QAL1.S 55.12,83.31 74.17,83.31 QAL2.S B-3.1 | B-5.1 QDL1.S 141.73,3.3 122.68,3.3 QDL2.S B-7.1 | B-2.1 QBL1.S 43.94,3.3 62.99,3.3 QBL2.S B-4.1 | B-6.1 152.91,76.2 QCL1.S 152.91,83.31 133.86,83.31 QCL2.S B-8.1
BAT1
  Top 0.406: D3.A 161.42,73.91 162.94,72.39 162.94,6.22 160.4,3.68 X1.1
BAT2
  Bottom 0.406: D4.A 161.42,60.71 161.42,52.58 161.54,52.58 162.31,51.82 162.31,7.49 160.4,7.49 X1.2
BIS  (via drill 0.61)
  Top 0.254: v29.84,41.66 v42.04,41.66 | v114.81,39.12 124.71,49.02 v124.71,50.42
  Bottom 0.254: v29.84,41.66 29.72,41.78 26.16,41.78 24.77,43.18 SV1.14 | v42.04,41.66 44.58,39.12 v114.81,39.12 | v124.71,50.42 125.86,51.56 137.54,51.56 U$5.3
COIL1  (via drill 0.81)
  Top 0.61: v60.45,40.13 69.34,31.24 U$3.1 | D5.C D2.A 156.84,60.71 159.64,57.91 159.64,27.43 161.8,25.27 161.8,16.51 160.4,15.11 X1.4 X1.3 | v116.71,31.24 118.11,32.64 v127.89,32.64
  Bottom 0.61: v60.45,40.13 49.02,40.13 46.48,42.67 C22.+ | v116.71,31.24 72.9,31.24 U$3.1 | v127.89,32.64 129.54,34.29 139.95,34.29 155.07,49.4 155.07,61.09 155.7,61.09 D2.A
GAH  (via drill 0.61)
  Top 0.406: DRV1.12 17.78,57.4 17.27,56.9 14.48,56.9 12.19,59.18 12.19,65.28 13.21,66.29 | 4.32,72.14 4.41,72.05 RGAH1.1 7.45,72.05 v11.43,68.07 | RGAH2.1 23.62,71.88 18.8,71.88 13.21,66.29 | 13.21,66.29 v13.72,65.79
  Bottom 0.406: v13.72,65.79 v11.43,68.07
GAH1  (via drill 0.61)
  Top 0.406: v87.25,71.5 83.95,71.5 RGCH2.1 | v100.84,71.37 101.73,71.37 101.73,71.5 RGCH1.1
  Top 0.61: DRV3.12 129.54,54.86 119.63,54.86 102.36,72.14 RGCH1.1
  Bottom 0.406: v87.25,71.5 87.38,71.37 v100.84,71.37
GAL  (via drill 0.61)
  Top 0.406: DRV1.6 21.59,53.85 22.35,54.61 26.42,54.61 37.34,65.53 | RGAL1.1 43.94,72.14 37.34,65.53 | v57.15,71.5 62.36,71.5 RGAL2.1 | 37.34,65.53 v37.21,65.66
  Bottom 0.406: v57.15,71.5 51.31,65.66 v37.21,65.66
GAL1
  Top 0.406: DRV3.6 133.35,51.82 136.65,55.12 136.65,57.91 141.73,62.99 RGCL1.1 141.1,72.26 140.08,73.28 140.08,80.52 133.1,80.52 132.08,79.5 132.08,71.37 127.64,71.37 127.51,71.5 123.32,71.5 RGCL2.1
GBH
  Top 0.406: DRV2.12 43.69,29.72 42.93,28.96 37.08,28.96 37.08,16.76 35.81,15.49 | RGBH2.1 34.8,14.48 35.81,15.49 | RGBH1.1 15.75,15.24 16,15.49 35.81,15.49
GBH1
  Top 0.406: DRV4.12 130.28,28.19 116.08,28.19 115.82,27.94 115.82,21.08 | 115.82,21.08 115.82,16.76 113.79,14.73 113.7,14.73 RGDH1.1 | RGDH2.1 95.92,16 108.97,16 113.03,20.07 113.03,21.08 115.82,21.08
GBL
  Top 0.406: 53.89,15.79 RGBL1.1 | 53.89,15.79 48.51,15.84 48.51,22.61 47.5,23.62 DRV2.6 47.5,24.64 | 53.89,15.79 53.85,15.75 72.99,15.75 RGBL2.1
GBL1
  Top 0.406: RGDL2.1 133.86,14.48 134.11,14.73 134.11,16 | 134.11,16 DRV4.6 | RGDL1.1 151.47,16 134.11,16
GND  (via drill 0.61)
  Top 0.61: v130.56,52.45 129.79,51.69 129.79,51.44 DRV3.3 129.29,49.53 129.29,49.28 126.62,46.61 126.62,44.58 R14.1 125.6,43.31 120.65,43.31 117.98,40.64 117.98,38.1 114.3,38.1 113.03,39.37 113.03,45.34 109.22,49.15 C20.- C19.+ 102.87,49.15 94.87,41.15 v94.87,34.8 | 129.79,22.48 130.05,22.48 130.05,23.11 DRV4.3 | 129.79,22.48 129.03,22.48 127.13,20.57 127.13,20.19 R15.1 | 154.18,27.05 154.18,64.9 156.08,66.8 156.08,73.91 D5.A 156.08,75.44 156.08,83.82 153.29,83.82 UTC.3 152.53,84.84 150.62,82.93 150.62,66.67 139.06,55.12 U$5.4 | 154.18,27.05 154.18,24.51 155.07,23.62 155.07,2.79 152.53,2.79 UTD.3 | v129.79,22.35 129.79,22.48 | 154.18,27.05 v152.65,27.05 | 43.43,22.99 42.93,22.99 41.27,21.34 41.27,20.95 R13.1 | 43.43,22.99 43.43,23.62 DRV2.3 | 80.9,20.57 80.9,23.24 90.04,32.38 U$3.4 90.04,34.16 84.33,39.88 84.33,49.91 U$1.4 83.57,51.69 81.66,53.59 81.66,83.95 74.55,83.95 UTA.3 | 80.9,20.57 80.9,2.79 73.79,2.79 UTB.3 | v44.07,22.86 43.69,22.86 43.43,22.99 | 80.9,20.57 v80.65,20.57 | R12.1 15.37,48.39 15.37,49.15 17.53,51.31 17.53,51.56 DRV1.3 | R4.16 14.35,38.86 15.11,38.86 R4.15 | R4.15 15.62,38.86 16.38,38.86 R4.14 16.89,38.86 17.65,38.86 R4.13 18.16,38.86 18.92,38.86 R4.12 19.43,38.86 20.19,38.86 R4.11 20.7,38.86 21.46,38.86 R4.10 21.97,38.86 22.73,38.86 R4.9 23.24,38.23 v24,37.47 | R12.1 15.11,47.12 15.11,39.62 R4.15 | SV1.9 3.43,47.62 2.54,46.74 2.54,42.16 3.43,41.27 SV1.15 3.43,40.01 2.29,38.86 2.29,19.18 2.41,19.05 4.7,19.05 4.7,19.68 C21.2 | C21.2 5.21,20.95 5.21,23.24 R8.2 | R6.1 SJ1.2 10.8,19.56 10.8,18.92 8.89,18.92 8.51,19.3 8.51,19.68 5.71,19.68 C21.2
  Top 0.61: v13.97,49.28 13.97,48.77 14.35,48.39 R12.1 | v29.84,36.96 36.2,36.96 v36.2,37.34 | v44.07,43.31 44.07,49.91 U$2.4
  Bottom 0.61: v130.56,52.45 135.89,52.45 137.54,54.1 U$5.4 | v129.79,22.35 131.95,24.51 148.72,24.51 151.26,27.05 v152.65,27.05 | v44.07,22.86 46.35,20.57 v80.65,20.57 | v13.97,49.28 13.72,49.53 5.33,49.53 4.45,48.64 SV1.9 | U$2.4 45.09,51.44 45.97,52.32 82.42,52.32 83.31,51.44 U$1.4 | v24,37.47 24.51,36.96 v29.84,36.96 | v36.2,37.34 42.16,43.31 v44.07,43.31 | v94.87,34.8 93.85,33.78 93.22,33.78 U$3.4
INA  (via drill 0.61)
  Top 0.254: v16.38,36.96 16.38,34.16 17.65,32.89 R4.4 | v12.19,40.26 12.19,51.69 12.64,52.13 | 12.64,52.13 12.7,52.2 14.99,52.2 DRV1.1 | v12.57,53.09 12.57,52.2 12.64,52.13
  Bottom 0.254: v16.38,36.96 13.08,40.26 v12.19,40.26 | v12.57,53.09 8.64,57.02 5.46,57.02 4.45,58.04 SV1.1
INB  (via drill 0.61)
  Top 0.254: v13.08,51.31 13.08,37.72 13.97,37.72 15.88,35.81 15.88,33.4 16.38,32.89 R4.3 16.89,31.5 v17.65,30.73 | v39.5,26.92 40.89,25.53 DRV2.1 | v36.2,29.72 34.8,31.11 26.67,31.11 v26.67,30.86
  Bottom 0.254: v13.08,51.31 9.65,54.74 5.21,54.74 4.45,55.5 SV1.3 | v39.5,26.92 36.7,29.72 v36.2,29.72 | v26.67,30.86 26.54,30.73 v17.65,30.73
INC  (via drill 0.61)
  Top 0.254: v18.03,36.96 18.03,33.78 18.92,32.89 R4.5 v19.18,29.84 | v9.78,41.15 7.49,43.43 7.49,51.31 6.6,52.2 4.19,52.2 4.19,52.7 SV1.5 | v117.48,52.58 124.59,52.58 125.73,51.44 126.75,51.44 DRV3.1 | v38.86,15.24 v42.42,18.8 | v32.13,18.8 22.86,28.07 v22.86,28.32
  Bottom 0.254: v18.03,36.96 13.84,41.15 v9.78,41.15 | v117.48,52.58 117.48,31.88 117.73,31.62 117.73,18.8 v42.42,18.8 | v38.86,15.24 35.31,18.8 v32.13,18.8 | v22.86,28.32 21.34,29.84 v19.18,29.84
IND  (via drill 0.61)
  Top 0.254: v19.3,36.96 19.3,35.05 21.46,32.89 R4.7 21.97,31.5 21.97,27.69 v32.13,17.53 | v117.6,9.53 117.6,13.21 127.51,23.11 DRV4.1 | v43.43,15.62 40.01,15.62 v40.01,13.97
  Bottom 0.254: v19.3,36.96 14.22,42.04 3.3,42.04 2.67,42.67 2.67,50.42 3.17,50.42 SV1.7 | v117.6,9.53 113.41,5.33 80.9,5.33 70.61,15.62 v43.43,15.62 | v40.01,13.97 39.62,14.35 35.31,14.35 v32.13,17.53
LM61PWR  (via drill 0.61)
  Top 0.254: 151.26,35.31 151.26,18.16 154.43,14.99 154.43,5.97 153.54,5.08 UTD.1 | 151.26,35.31 151.26,81.28 151.51,81.53 UTC.1 | C21.1 3.56,20.95 3.56,23.24 R8.1 4.06,24.51 4.06,25.02 6.1,25.02 6.22,24.89 6.22,24.51 9.02,24.51 R7.1 10.16,24.51 v10.16,25.53 | UTA.1 73.66,81.53 74.68,80.52 76.07,80.52 v76.07,38.23 76.07,6.35 74.8,5.08 UTB.1 | v24.13,31.75 26.16,33.78 v26.16,37.97 | v29.08,37.97 31.11,40.01 v42.04,40.01 | v139.45,35.31 151.26,35.31 | v123.83,35.31 122.43,35.31 121.92,34.8 v114.43,34.8
  Bottom 0.254: v10.16,25.53 16.38,31.75 v24.13,31.75 | v26.16,37.97 v29.08,37.97 | v42.04,40.01 43.81,38.23 v76.07,38.23 76.45,37.97 111.25,37.97 v114.43,34.8 | v123.83,35.31 v139.45,35.31
LMIS  (via drill 0.61)
  Top 0.254: v19.81,45.21 v24,41.02 | v27.94,40.01 27.94,42.8 28.45,43.31 28.45,43.56 31.5,46.61 36.96,46.61 v36.96,46.74
  Bottom 0.254: v19.81,45.21 7.11,45.21 6.99,45.34 SV1.12 | v24,41.02 25.02,40.01 v27.94,40.01 | v36.96,46.74 38.99,48.77 83.95,48.77 85.6,50.42 U$1.3
MA1
  Top 0.61: CVB3.- 134.62,61.47 131.19,58.04 131.19,57.78 131.06,57.66 DRV3.11 130.56,55.75 130.56,53.72 119.25,53.72 118.05,54.93 | 118.05,54.93 102.87,70.1 98.81,70.1 MC2.1 | R5.1 114.68,43.05 115.06,43.43 115.06,51.94 118.05,54.93
  Top 1.016: 113.54,73.66 113.03,73.66 114.3,72.39
  Top 3.81: MC1.1 113.54,73.66 QCH1.S 113.54,83.31 94.49,83.31 | MC2.1 QCH2.S 94.49,83.31 | 147.32,83.31 QCL1.D MC3.1 | 94.49,83.31 147.32,83.31 | MC4.1 QCL2.D 128.27,83.31 147.32,83.31
MA2
  Top 0.61: QAH2.S MA2.1 | QAH1.S MA1.1 15.75,70.1 11.43,65.79 11.43,58.93 14.22,56.13 17.78,56.13 19.05,57.4 DRV1.11 19.3,59.69 19.43,59.82 19.43,60.07 21.08,61.72 23.62,61.72 23.62,62.36 CVB1.- | QAL1.D MA3.1 | QAL2.D MA4.1
  Top 3.81: 34.8,83.31 QAH2.S | 49.53,83.31 QAL1.D | 34.8,83.31 49.53,83.31 | QAL2.D 68.58,83.31 49.53,83.31 | QAH1.S 15.75,83.31 34.8,83.31
  Bottom 0.813: R3.1 26.67,66.8 19.05,74.42 MA1.1
MB1
  Top 0.61: CVB4.- 135.38,35.05 131.95,31.62 131.95,31.37 131.83,31.24 DRV4.11 131.57,27.43 116.59,27.43 116.59,3.3 | C8.2 111.25,16.76 111.25,3.3
  Top 3.81: MD1.1 QDH1.S 102.36,3.3 83.31,3.3 | 83.31,3.3 QDH2.S MD2.1 | MD3.1 QDL1.D 147.32,3.3 136.14,3.3 | 83.31,3.3 111.25,3.3 116.59,3.3 136.14,3.3 | 128.27,8.64 128.27,3.3 136.14,3.3 | 128.27,8.64 QDL2.D | 128.27,8.64 MD4.1
  Bottom 0.813: MD1.1 102.87,13.46
  Bottom 3.81: MD2.1 83.31,8.89 | MD1.1 102.36,8.89 | 128.27,8.64 QDL2.D MD4.1 | MD3.1 147.32,8.89
MB2
  Top 0.61: CVB2.- 48.51,35.31 45.34,32.13 45.34,31.88 45.21,31.75 DRV2.11 44.96,29.72 43.18,27.94 37.85,27.94 37.85,3.3
  Top 3.81: MB1.1 4.57,3.3 23.62,3.3 | 23.62,3.3 MB2.1 | 49.53,3.3 MB3.1 | 23.62,3.3 37.85,3.3 49.53,3.3 | MB4.1 68.58,3.3 49.53,3.3
  Bottom 0.813: MB2.1 24.13,13.46 26.67,16 C1.2
  Bottom 3.81: MB1.1 QBH1.S | 23.62,8.64 QBH2.S MB2.1 | 49.53,8.64 QBL1.D MB3.1 | 68.58,8.64 QBL2.D MB4.1
N$1
  Top 0.61: R11.2 D2.C
N$2
  Top 0.254: C1.1 R3.2
N$3
  Top 0.254: R12.2 17.14,48.39 18.8,50.04 18.8,51.56 DRV1.4
N$4
  Top 0.254: C8.1 R5.2
N$5
  Top 0.254: R14.2 128.4,44.58 130.56,46.74 130.56,49.53 DRV3.4
N$6
  Top 0.254: R15.2 128.91,20.19 131.32,22.61 131.32,23.11 DRV4.4
N$7
  Bottom 0.406: R10.2 156.08,26.8 160.15,30.86 160.4,30.86 R9.1
N$8
  Top 0.406: R9.2 D4.C 161.42,52.07 162.31,52.96 162.31,62.87 161.42,63.75 D3.C
N$9
  Top 0.254: R13.2 43.05,20.95 44.32,20.95 44.32,21.84 44.96,22.48 DRV2.4
N$10
  Top 0.61: R10.1 160.4,22.61 160.4,18.92 X1.5
Q1G
  Top 0.406: RGAH1.2 QAH1.G
Q1G1
  Top 0.406: RGCH1.2 QCH1.G
Q2G
  Top 0.406: RGAH2.2 QAH2.G
Q2G1
  Top 0.406: RGCH2.2 QCH2.G
Q3G
  Top 0.406: RGAL1.2 QAL1.G
Q3G1
  Top 0.406: RGCL1.2 QCL1.G
Q4G
  Top 0.406: RGAL2.2 QAL2.G
Q4G1
  Top 0.406: RGCL2.2 QCL2.G
Q5G
  Top 0.406: QBH1.G RGBH1.2
Q5G1
  Top 0.406: QDH1.G RGDH1.2
Q6G
  Top 0.406: QBH2.G RGBH2.2
Q6G1
  Top 0.406: QDH2.G RGDH2.2
Q7G
  Top 0.406: QBL1.G RGBL1.2
Q7G1
  Top 0.406: 152.91,8.64 QDL1.G RGDL1.2
Q8G
  Top 0.406: QBL2.G RGBL2.2
Q8G1
  Top 0.406: QDL2.G RGDL2.2
RMIS  (via drill 0.61)
  Top 0.254: v21.97,44.32 v24,42.29 | v28.83,40.89 28.96,41.02 28.96,43.31 31.5,45.85 37.85,45.85 v37.85,48.9
  Bottom 0.254: v21.97,44.32 5.21,44.32 4.45,43.56 SV1.13 | v24,42.29 25.4,40.89 v28.83,40.89 | v37.85,48.9 38.23,49.28 44.83,49.28 45.97,50.42 U$2.3
TEMPA  (via drill 0.61)
  Top 0.254: v27.05,33.78 27.05,42.67 27.81,43.43 27.81,48.9 35.81,48.9 37.08,50.16 37.08,52.2 50.04,52.2 70.87,73.03 70.87,83.31 74.17,83.31 74.68,82.8 UTA.2
  Bottom 0.254: v27.05,33.78 25.4,35.43 13.21,35.43 10.67,37.97 6.99,37.97 SV1.18
TEMPB  (via drill 0.61)
  Top 0.254: v41.27,6.35 41.27,6.1 44.58,6.1 45.59,7.11 45.59,15.11 50.29,15.11 51.82,13.59 51.82,6.1 55.75,6.1 56.64,6.99 56.64,15.11 69.34,15.11 70.87,13.59 70.87,6.22 72.01,5.08 UTB.2 | v17.91,16.51 v31.11,16.51
  Bottom 0.254: v31.11,16.51 v41.27,6.35 | v17.91,16.51 13.46,20.95 9.65,20.95 2.67,27.94 2.67,37.72 3.17,37.72 SV1.17
TEMPC  (via drill 0.61)
  Top 0.254: v152.15,55.5 152.15,63.88 154.56,66.29 154.56,81.28 154.3,81.53 UTC.2 | v125.22,36.45 124.71,35.94 124.71,34.92 123.06,33.27 v94.87,33.27 | v27.69,32.64 v36.2,32.64
  Bottom 0.254: v152.15,55.5 133.1,36.45 v125.22,36.45 | v94.87,33.27 93.47,31.88 72.9,31.88 72.14,32.64 v36.2,32.64 | v27.69,32.64 9.53,32.64 6.99,35.18 SV1.20
TEMPD  (via drill 0.61)
  Top 0.254: v151.38,14.73 151.38,5.08 UTD.2 | v123.83,30.48 122.81,30.48 122.43,30.1 v97.03,30.1 | v36.83,30.86 35.81,30.86 34.92,31.75 25.15,31.75 v25.15,29.34
  Bottom 0.254: v151.38,14.73 151.38,26.16 153.03,26.16 157.61,30.73 157.61,32.38 148.08,32.38 145.41,29.72 124.59,29.72 v123.83,30.48 | v97.03,30.1 95.25,28.32 42.04,28.32 39.5,30.86 v36.83,30.86 | v25.15,29.34 20.45,24.64 9.78,24.64 4.19,30.23 4.19,34.92 SV1.19
VB1
  Top 0.61: 18.8,63.5 DB1.C | 18.8,63.5 CVB1.+ | 16.51,58.67 DRV1.13 16.51,61.21 18.8,63.5
VB2
  Top 0.61: 43.69,35.31 DB2.C | 43.69,35.31 CVB2.+ | 42.42,30.73 DRV2.13 42.42,34.04 43.69,35.31
VB3
  Top 0.61: CVB3.+ DB3.C 128.27,60.89 DRV3.13 128.27,56.64
VB4
  Top 0.61: CVB4.+ DB4.C 129.03,34.54 DRV4.13
VBATSENSE
  Top 0.254: R6.2 17.27,20.95 17.27,21.21 16.76,21.72 16.76,23.5 R2.1 15.62,24.77 9.4,30.99 9.4,37.34 6.73,40.01 SV1.16